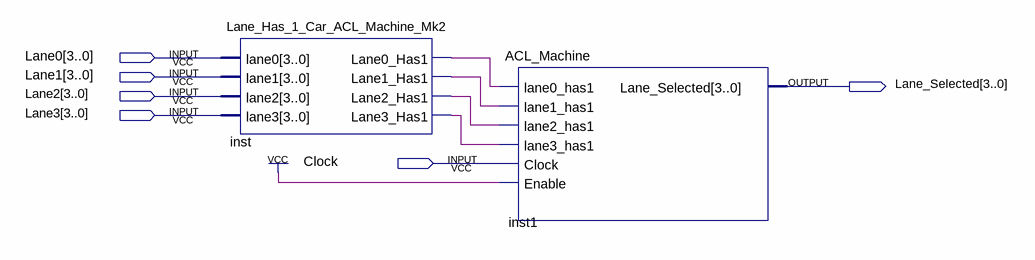
[diagram p0: schematic sheet]
// Quartus schematic ACL_Machine_Mk2.bdf as structural Verilog: 2 symbols, 6 pins
module ACL_Machine_Mk2 (
  input  [3:0] Lane0,
  input  [3:0] Lane1,
  input  [3:0] Lane2,
  input  [3:0] Lane3,
  input  Clock,
  output [3:0] Lane_Selected
);

  wire inst_lane0_has1, inst_lane1_has1, inst_lane2_has1, inst_lane3_has1;

  Lane_Has_1_Car_ACL_Machine_Mk2 inst (
    .lane0(Lane0), .lane1(Lane1), .lane2(Lane2), .lane3(Lane3), .Lane0_Has1(inst_lane0_has1),
    .Lane1_Has1(inst_lane1_has1), .Lane2_Has1(inst_lane2_has1), .Lane3_Has1(inst_lane3_has1));
  ACL_Machine inst1 (
    .lane0_has1(inst_lane0_has1), .lane1_has1(inst_lane1_has1), .lane2_has1(inst_lane2_has1),
    .lane3_has1(inst_lane3_has1), .Clock(Clock), .Enable(1'b1), .Lane_Selected(Lane_Selected));
endmodule
